# Altium schematic sheet BorneChargement.SchDoc
size A4
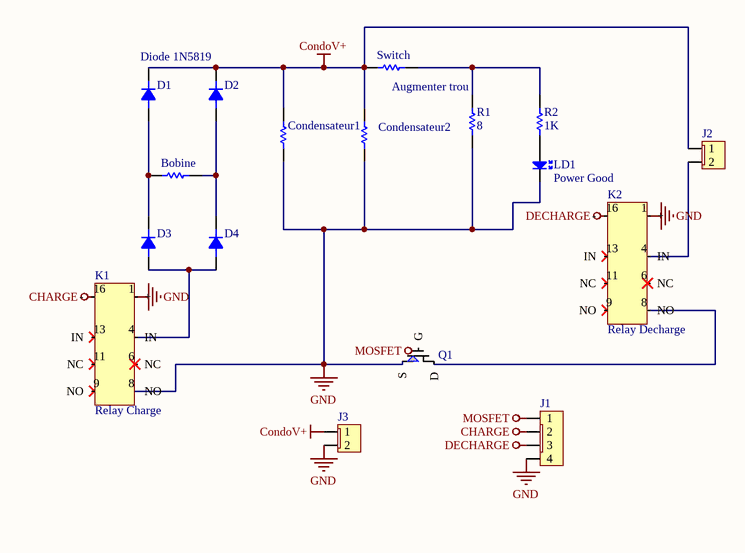
[diagram p0: BorneChargement.SchDoc]

## Parts
Bobine  Res 1/4W  [Axial 0.4" Step]  (value not drawn)
Condensateur1  Res 1/4W  [Axial 0.4" Step]  (value not drawn)
Condensateur2  Res 1/4W  [Axial 0.4" Step]  (value not drawn)
D1  Diode 1N5819  [DO-41]
D2  Diode 1N4004  [DO-41]  (value not drawn)
D3  Diode 1N4004  [DO-41]  (value not drawn)
D4  Diode 1N4004  [DO-41]  (value not drawn)
J1  MTA100-4  [MTA100-4 MF]  (value not drawn)
J2  Input  [MTA100-2]  (value not drawn)
J3  Input  [MTA100-2]  (value not drawn)
K1  Relay Charge  [PCBComponent_1]
K2  Relay Decharge  [PCBComponent_1]
LD1  Power Good  [LED 3mm Vertical]
Q1  Component_1  [PCBComponent_1]  (value not drawn)
R1  value 8  [Axial 0.4" Step]  (hidden comment: Res 1/4W)
R2  value 1K  [Axial 0.4" Step]  (hidden comment: Res 1/4W)
Switch  Res 1/4W  [Axial 0.4" Step]  (value not drawn)

## Nets
CHARGE: J1.2 K1.16(-)
CondoV+: Condensateur1.1 Condensateur2.1 D1.1 D2.1 J2.1 J3.1 Switch.1
DECHARGE: J1.3 K2.16(-)
GND: Condensateur1.2 Condensateur2.2 J1.4 J3.2 K1.1(+) K1.8(NO) K2.1(+) LD1.2(K) Q1.S R1.1
MOSFET: J1.1 Q1.G
NetBobine_1: Bobine.1 D2.2 D4.1
NetBobine_2: Bobine.2 D1.2 D3.1
NetD3_2: D3.2 D4.2 K1.4(IN)
NetJ2_2: J2.2 K2.4(IN)
NetK2_8: K2.8(NO) Q1.D
NetLD1_1: LD1.1(A) R2.1
NetR1_2: R1.2 R2.2 Switch.2

Not connected (* = marked no-connect by the designer): K1 6(NC)* 9(NO)* 11(NC)* 13(IN)*; K2 6(NC)* 9(NO)* 11(NC)* 13(IN)*

## Notes on the sheet
- Augmenter trou

## Library data of the parts
Bobine Condensateur1 Condensateur2 Switch = Res 1/4W: Resistor; Value: 1K; Published: 8-Jun-2000; LatestRevisionDate: 17-Jul-2002; LatestRevisionNote: Re-released for DXP Platform.; PackageReference: AXIAL-0.3; Publisher: Altium Limited; PackageDescription: Axial Device, Thru-Hole; 2 Leads; 0.3 in Pin Spacing
D1 = Diode 1N4004: Diode; Value: 1N4004; Published: 8-Jun-2000; LatestRevisionDate: 17-Jul-2002; LatestRevisionNote: Re-released for DXP Platform.; PackageReference: AXIAL-0.4; Publisher: Altium Limited; PackageDescription: Axial Device, Thru-Hole; 2 Leads; 0.4 in Pin Spacing
D2-D4 = Diode 1N4004: Diode; Published: 8-Jun-2000; LatestRevisionDate: 17-Jul-2002; LatestRevisionNote: Re-released for DXP Platform.; PackageReference: AXIAL-0.4; Publisher: Altium Limited; PackageDescription: Axial Device, Thru-Hole; 2 Leads; 0.4 in Pin Spacing; Value: 1N4004
J1 = MTA100-4: MTA100-4M; Connector Type: MTA100-4
J2 J3 = MTA100-2: MTA Male 0 Degres
  J2: Connector Type: MTA100-2
K1 K2 = Component_1
LD1 = LED 3mm Vertical: Through Hole; Published: 8-Jun-2000; LatestRevisionDate: 08-Jul-2005; LatestRevisionNote: Mech Layer 1 removed.; PackageReference: LED-1; Publisher: Altium Limited; PackageDescription: LED; 2 Leads; Comment_1: LED 3mm Vertical
R1 R2 = Res 1/4W: Resistor; Published: 8-Jun-2000; LatestRevisionDate: 17-Jul-2002; LatestRevisionNote: Re-released for DXP Platform.; PackageReference: AXIAL-0.3; Publisher: Altium Limited; PackageDescription: Axial Device, Thru-Hole; 2 Leads; 0.3 in Pin Spacing